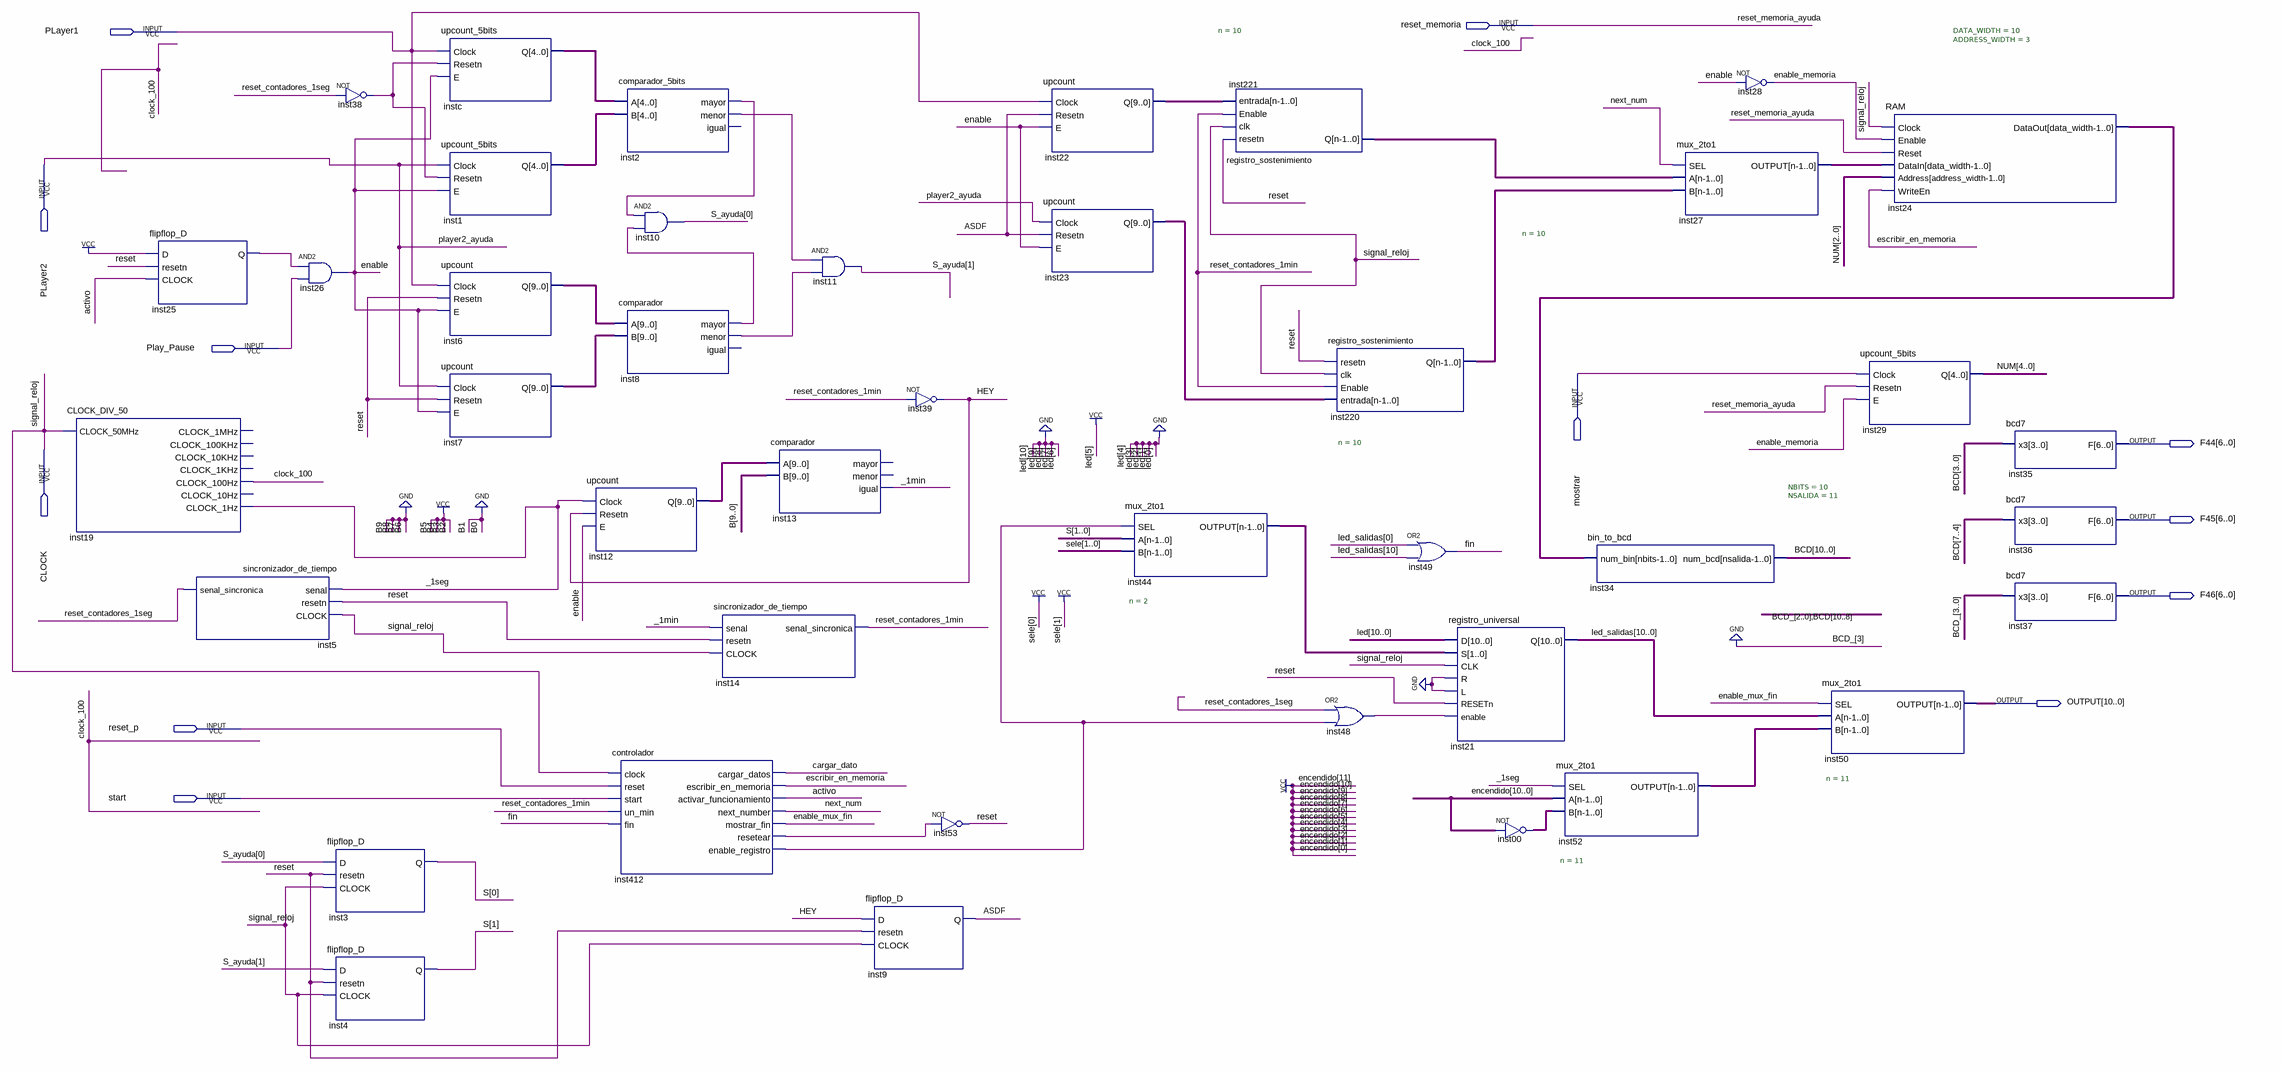
[diagram p0: schematic sheet]
// Quartus schematic proyecto.bdf as structural Verilog: 41 symbols, 12 pins
module proyecto (
  input  reset_memoria,
  input  PLayer1,
  input  PLayer2,
  input  Play_Pause,
  input  mostrar,
  input  CLOCK,
  input  reset_p,
  input  start,
  output [6:0] F44,
  output [6:0] F45,
  output [6:0] F46,
  output [10:0] OUTPUT
);

  wire _1min, _1seg, activo, ASDF, cargar_dato, clock_100, enable, enable_memoria, enable_mux_fin,
       escribir_en_memoria, fin, HEY, inst2_mayor, inst2_menor, inst8_mayor, inst8_menor, inst25_q,
       inst38_out, inst48_out, inst412_enable_registro, inst412_resetear, next_num, reset,
       reset_contadores_1min, reset_contadores_1seg;
  wire [1:0] inst44_output, S, S_ayuda;
  wire [2:0] BCD_;
  wire [4:0] inst1_q, instc_q, NUM;
  wire [9:0] inst6_q, inst7_q, inst12_q, inst22_q, inst23_q, inst24_dataout, inst27_output, inst220_q,
       inst221_q;
  wire [10:0] BCD, inst00_out, inst52_output, led_salidas;

  CLOCK_DIV_50 inst19 (
    .CLOCK_50MHz(CLOCK), .CLOCK_100Hz(clock_100), .CLOCK_1Hz(_1seg));  // open: CLOCK_1MHz, CLOCK_100KHz, CLOCK_10KHz, CLOCK_1KHz, CLOCK_10Hz
  flipflop_D inst25 (.D(1'b1), .resetn(reset), .CLOCK(activo), .Q(inst25_q));
  sincronizador_de_tiempo inst5 (
    .senal(_1seg), .resetn(reset), .CLOCK(CLOCK), .senal_sincronica(reset_contadores_1seg));
  and inst26 (enable, inst25_q, Play_Pause);
  not inst38 (inst38_out, reset_contadores_1seg);
  flipflop_D inst3 (.D(S_ayuda[0]), .resetn(reset), .CLOCK(CLOCK), .Q(S[0]));
  flipflop_D inst4 (.D(S_ayuda[1]), .resetn(reset), .CLOCK(CLOCK), .Q(S[1]));
  upcount_5bits instc (.Clock(PLayer1), .Resetn(inst38_out), .E(enable), .Q(instc_q));
  upcount_5bits inst1 (.Clock(PLayer2), .Resetn(inst38_out), .E(enable), .Q(inst1_q));
  upcount inst6 (.Clock(PLayer1), .Resetn(reset), .E(enable), .Q(inst6_q));
  upcount inst7 (.Clock(PLayer2), .Resetn(reset), .E(enable), .Q(inst7_q));
  upcount inst12 (.Clock(_1seg), .Resetn(HEY), .E(enable), .Q(inst12_q));
  controlador inst412 (
    .clock(CLOCK), .reset(reset_p), .start(start), .un_min(reset_contadores_1min), .fin(fin),
    .cargar_datos(cargar_dato), .escribir_en_memoria(escribir_en_memoria), .activar_funcionamiento(activo),
    .next_number(next_num), .mostrar_fin(enable_mux_fin), .resetear(inst412_resetear),
    .enable_registro(inst412_enable_registro));
  comparador_5bits inst2 (.A(instc_q), .B(inst1_q), .mayor(inst2_mayor), .menor(inst2_menor));  // open: igual
  and inst10 (S_ayuda[0], inst2_mayor, inst8_mayor);
  comparador inst8 (.A(inst6_q), .B(inst7_q), .mayor(inst8_mayor), .menor(inst8_menor));  // open: igual
  sincronizador_de_tiempo inst14 (
    .senal(_1min), .resetn(reset), .CLOCK(CLOCK), .senal_sincronica(reset_contadores_1min));
  and inst11 (S_ayuda[1], inst2_menor, inst8_menor);
  comparador inst13 (.A(inst12_q), .B(10'b0000111100), .igual(_1min));  // open: mayor, menor
  flipflop_D inst9 (.D(HEY), .resetn(reset), .CLOCK(CLOCK), .Q(ASDF));
  not inst39 (HEY, reset_contadores_1min);
  not inst53 (reset, inst412_resetear);
  upcount inst22 (.Clock(PLayer1), .Resetn(ASDF), .E(enable), .Q(inst22_q));
  upcount inst23 (.Clock(PLayer2), .Resetn(ASDF), .E(enable), .Q(inst23_q));
  mux_2to1 #(.n(2)) inst44 (.SEL(inst412_enable_registro), .A(S), .B(2'b11), .OUTPUT(inst44_output));
  registro_sostenimiento #(.n(10)) inst221 (
    .resetn(reset), .clk(CLOCK), .Enable(reset_contadores_1min), .entrada(inst22_q), .Q(inst221_q));
  registro_sostenimiento #(.n(10)) inst220 (
    .resetn(reset), .clk(CLOCK), .Enable(reset_contadores_1min), .entrada(inst23_q), .Q(inst220_q));
  or inst48 (inst48_out, reset_contadores_1seg, inst412_enable_registro);
  or inst49 (fin, led_salidas[0], led_salidas[10]);
  registro_universal inst21 (
    .D(11'b00000100000), .S(inst44_output), .CLK(CLOCK), .R(1'b0), .L(1'b0), .RESETn(reset),
    .enable(inst48_out), .Q(led_salidas));
  assign inst00_out = ~{11{1'b1}};  // NOT inst00, 11 bits wide
  mux_2to1 #(.n(11)) inst52 (.SEL(_1seg), .A({11{1'b1}}), .B(inst00_out), .OUTPUT(inst52_output));
  bin_to_bcd #(.NBITS(10), .NSALIDA(11)) inst34 (.num_bin(inst24_dataout), .num_bcd(BCD));
  mux_2to1 #(.n(10)) inst27 (.SEL(next_num), .A(inst221_q), .B(inst220_q), .OUTPUT(inst27_output));
  not inst28 (enable_memoria, enable);
  mux_2to1 #(.n(11)) inst50 (.SEL(enable_mux_fin), .A(led_salidas), .B(inst52_output), .OUTPUT(OUTPUT));
  upcount_5bits inst29 (.Clock(mostrar), .Resetn(reset_memoria), .E(enable_memoria), .Q(NUM));
  RAM #(.DATA_WIDTH(10), .ADDRESS_WIDTH(3)) inst24 (
    .Clock(CLOCK), .Enable(enable_memoria), .Reset(reset_memoria), .DataIn(inst27_output),
    .Address(NUM[2:0]), .WriteEn(escribir_en_memoria), .DataOut(inst24_dataout));
  bcd7 inst35 (.x3(BCD[3:0]), .F(F44));
  bcd7 inst36 (.x3(BCD[7:4]), .F(F45));
  bcd7 inst37 (.x3({1'b0, BCD_}), .F(F46));

  // Other names for the same wires on the sheet: player2_ayuda = PLayer2; reset_memoria_ayuda = reset_memoria;
  //   signal_reloj = CLOCK
endmodule
